# Altium schematic sheet MCU-Power.SchDoc: =ProjectTitle
size 297 x 209 mm; Address1: Address1; Address2: Address2; Address3: Address3; Address4: Address4; SheetNumber: 2; SheetTotal: 16; Scale: 1:1; DocumentType: Схема электрическая принципиальная
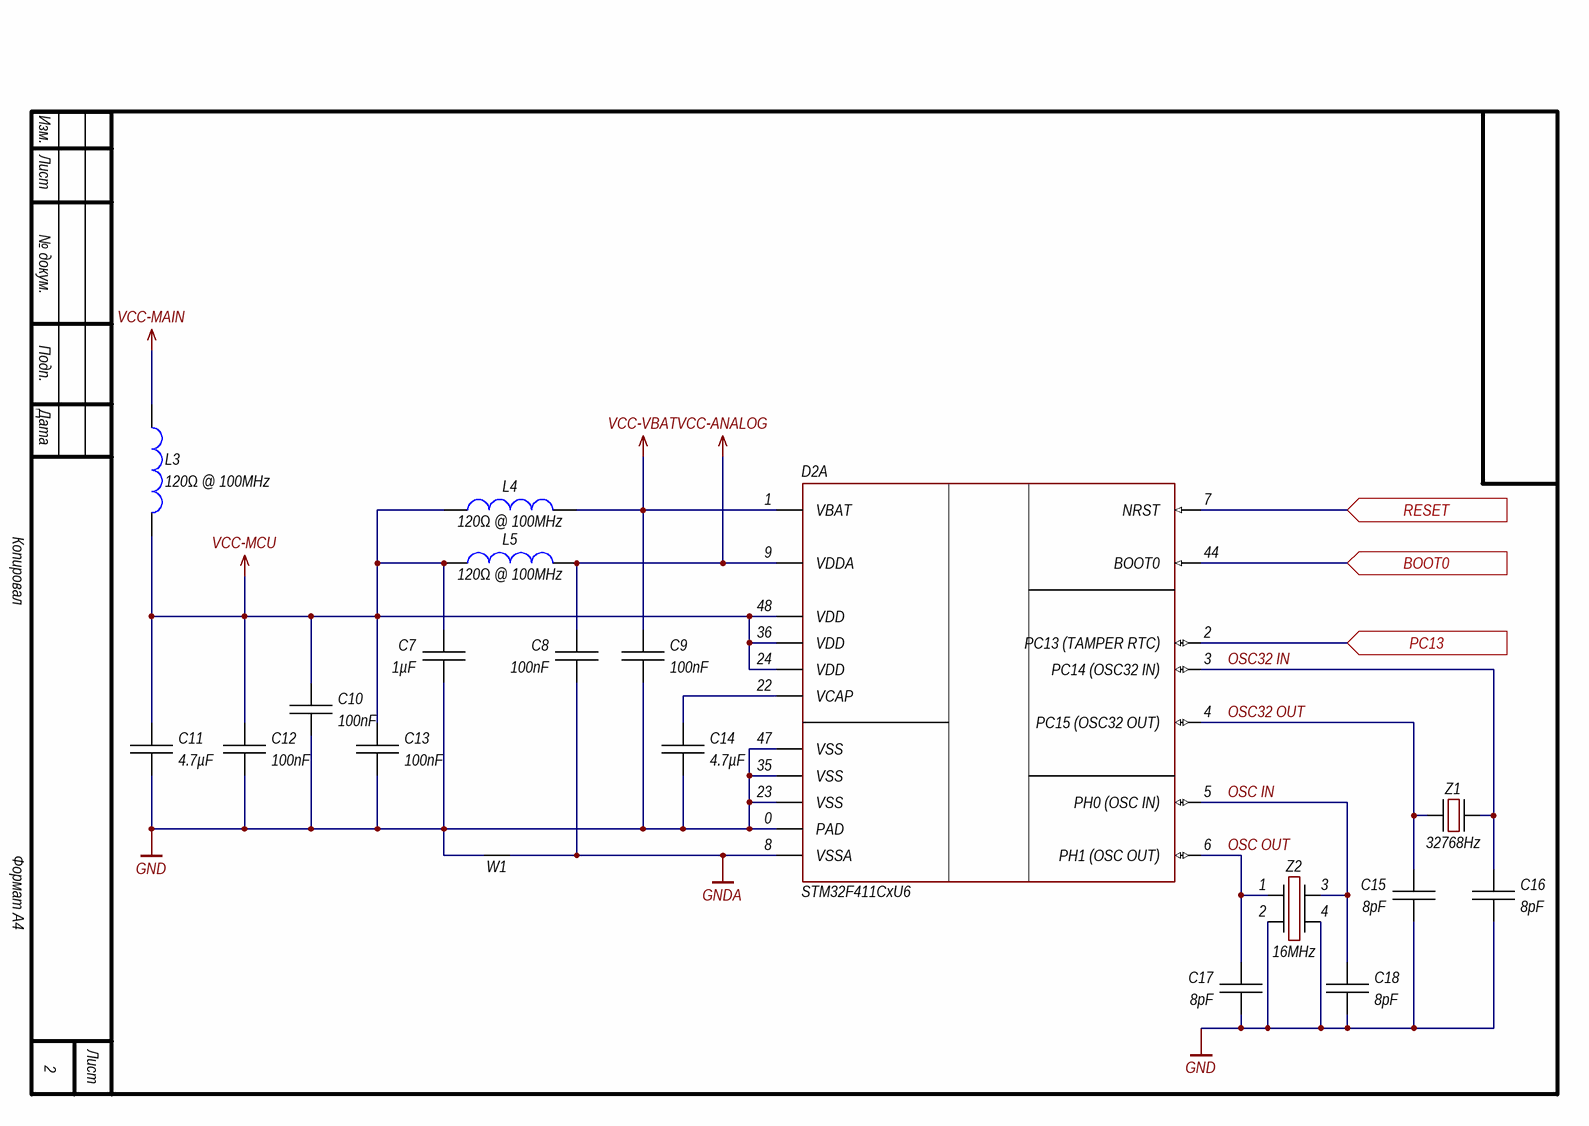
[diagram p0: MCU-Power.SchDoc]

## Parts
C7  1µF  [CH0402C]
C8  100nF  [CH0402C]
C9  100nF  [CH0402C]
C10  100nF  [CH0402C]
C11  4.7µF  [CH0402C]
C12  100nF  [CH0402C]
C13  100nF  [CH0402C]
C14  4.7µF  [CH0402C]
C15  8pF  [CH0402C]
C16  8pF  [CH0402C]
C17  8pF  [CH0402C]
C18  8pF  [CH0402C]
D2  STM32F411CxU6  [48-UFQFPN]  (part A of 2)
L3  120Ω @ 100MHz  [CH0402L]
L4  120Ω @ 100MHz  [CH0402L]
L5  120Ω @ 100MHz  [CH0402L]
W1  Net Tie  [CON: Net Tie 1.1x0.5]  (value not drawn)  (net tie, no BOM)
Z1  32768Hz  [OSC: 2012]
Z2  16MHz  [OSC: 2520]

## Ports
BOOT0 (in), PC13 (in), RESET (in)

## Nets
GND: C7.1 C9.1 C10.1 C11.1 C12.1 C13.1 C14.1 C15.1 C16.1 C17.1 C18.1 D2.0(PAD) D2.23(VSS) D2.35(VSS) D2.47(VSS) W1.1 Z2.2 Z2.4
GNDA: C8.1 D2.8(VSSA) W1.2
VCC-ANALOG: C8.2 D2.9(VDDA) L5.1
VCC-MAIN: L3.2
VCC-MCU: C7.2 C10.2 C11.2 C12.2 C13.2 D2.24(VDD) D2.36(VDD) D2.48(VDD) L3.1 L4.2 L5.2
VCC-VBAT: C9.2 D2.1(VBAT) L4.1
BOOT0: D2.44(BOOT0) ; port BOOT0
OSC32 IN: C16.2 D2.3(PC14_(OSC32_IN)) Z1.3
OSC32 OUT: C15.2 D2.4(PC15_(OSC32_OUT)) Z1.1
OSC IN: C18.2 D2.5(PH0_(OSC_IN)) Z2.3
OSC OUT: C17.2 D2.6(PH1_(OSC_OUT)) Z2.1
PC13: D2.2(PC13_(TAMPER_RTC)) ; port PC13
RESET: D2.7(NRST) ; port RESET
NetC14_2: C14.2 D2.22(VCAP)

## Notes on the sheet
- Изм.
- Лист
- № докум.
- Подп.
- Дата
- Копировал
- Формат А4

## Library data of the parts
C7-C18 = Capacitor: Manufacturer: *; Model: *; HelpURL: *; ComponentKind: *
  C7: Value: 1µF
  C8-C10 C12 C13: Value: 100nF
  C11 C14: Value: 4.7µF
  C15-C18: Value: 8pF
D2 = STM32F411CxU6: STM32, Cortex-M4; Manufacturer: ST Microelectronics; Model: STM32F411CxU6; ComponentKind: STM32, 2.0-3.6V, 48-UFQFPN; HelpURL: https://datasheet.lcsc.com/lcsc/2107091825_STMicroelectronics-STM32F411VCT6_C1339312.pdf
L3-L5 = Inductor: Manufacturer: *; Model: *; HelpURL: *; ComponentKind: *; Value: 120Ω @ 100MHz
Z1 = Oscillator: Manufacturer: *; Model: *; HelpURL: *; ComponentKind: *; Value: 32768Hz
Z2 = Generator: Manufacturer: *; Model: *; HelpURL: *; ComponentKind: *; Value: 16MHz